# EAGLE design cropdroid-doser (EAGLE 9.7.0)
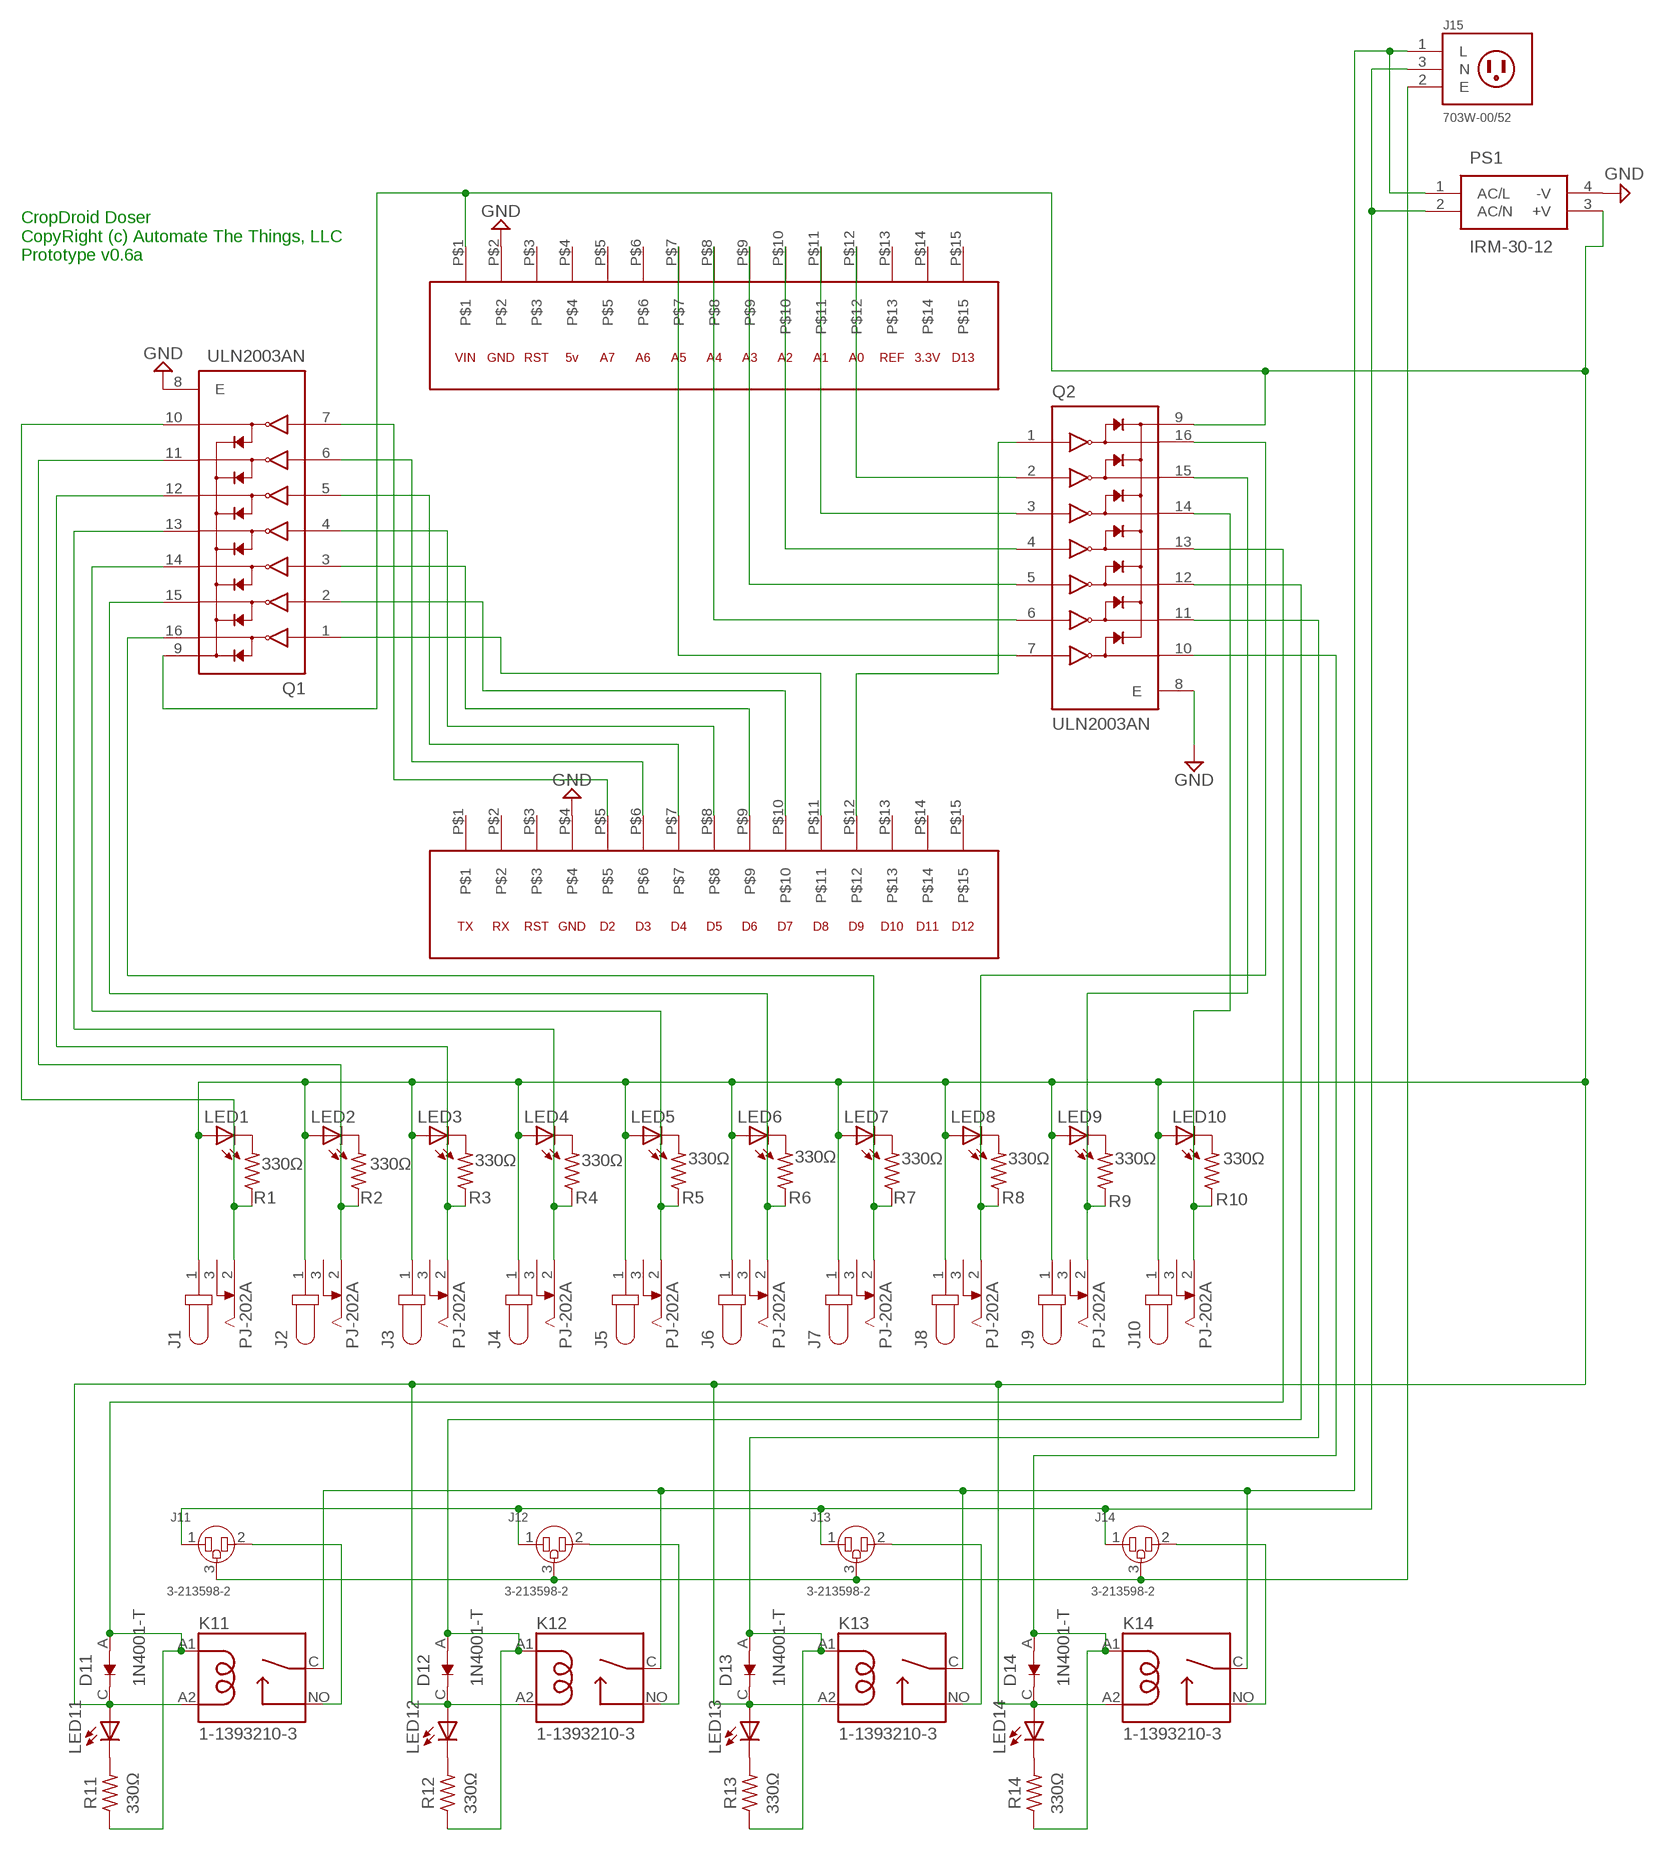
[diagram p0: schematic, sheet 1]

## Parts
D11  1N4001-T  [DIOAD953W69L521D272]
D12  1N4001-T  [DIOAD953W69L521D272]
D13  1N4001-T  [DIOAD953W69L521D272]
D14  1N4001-T  [DIOAD953W69L521D272]
J1  PJ-202A  [CUI_PJ-202A]
J2  PJ-202A  [CUI_PJ-202A]
J3  PJ-202A  [CUI_PJ-202A]
J4  PJ-202A  [CUI_PJ-202A]
J5  PJ-202A  [CUI_PJ-202A]
J6  PJ-202A  [CUI_PJ-202A]
J7  PJ-202A  [CUI_PJ-202A]
J8  PJ-202A  [CUI_PJ-202A]
J9  PJ-202A  [CUI_PJ-202A]
J10  PJ-202A  [CUI_PJ-202A]
J11  3-213598-2  [TE_3-213598-2]
J12  3-213598-2  [TE_3-213598-2]
J13  3-213598-2  [TE_3-213598-2]
J14  3-213598-2  [TE_3-213598-2]
J15  703W-00/52  [QUALTEK_703W-00/52]
K11  1-1393210-3  [TE_1-1393210-3]
K12  1-1393210-3  [TE_1-1393210-3]
K13  1-1393210-3  [TE_1-1393210-3]
K14  1-1393210-3  [TE_1-1393210-3]
LED1  LED3MM  [LED3MM]
LED2  LED3MM  [LED3MM]
LED3  LED3MM  [LED3MM]
LED4  LED3MM  [LED3MM]
LED5  LED3MM  [LED3MM]
LED6  LED3MM  [LED3MM]
LED7  LED3MM  [LED3MM]
LED8  LED3MM  [LED3MM]
LED9  LED3MM  [LED3MM]
LED10  LED3MM  [LED3MM]
LED11  LED3MM  [LED3MM]
LED12  LED3MM  [LED3MM]
LED13  LED3MM  [LED3MM]
LED14  LED3MM  [LED3MM]
PS1  IRM-30-12  [IRM3048]
Q1  ULN2003AN  [DIP794W45P254L1969H508Q16]
Q2  ULN2003AN  [DIP794W45P254L1969H508Q16]
R1  330Ω  R-US_AXIAL-7.2MM-PITCH  [RESAD724W46L381D178B]
R2  330Ω  R-US_AXIAL-7.2MM-PITCH  [RESAD724W46L381D178B]
R3  330Ω  R-US_AXIAL-7.2MM-PITCH  [RESAD724W46L381D178B]
R4  330Ω  R-US_AXIAL-7.2MM-PITCH  [RESAD724W46L381D178B]
R5  330Ω  R-US_AXIAL-7.2MM-PITCH  [RESAD724W46L381D178B]
R6  330Ω  R-US_AXIAL-7.2MM-PITCH  [RESAD724W46L381D178B]
R7  330Ω  R-US_AXIAL-7.2MM-PITCH  [RESAD724W46L381D178B]
R8  330Ω  R-US_AXIAL-7.2MM-PITCH  [RESAD724W46L381D178B]
R9  330Ω  R-US_AXIAL-7.2MM-PITCH  [RESAD724W46L381D178B]
R10  330Ω  R-US_AXIAL-7.2MM-PITCH  [RESAD724W46L381D178B]
R11  330Ω  R-US_AXIAL-7.2MM-PITCH  [RESAD724W46L381D178B]
R12  330Ω  R-US_AXIAL-7.2MM-PITCH  [RESAD724W46L381D178B]
R13  330Ω  R-US_AXIAL-7.2MM-PITCH  [RESAD724W46L381D178B]
R14  330Ω  R-US_AXIAL-7.2MM-PITCH  [RESAD724W46L381D178B]
U$1  PPTC151LFBN-RC  [PPTC151LFBN-RC]
U$2  PPTC151LFBN-RC  [PPTC151LFBN-RC]

## Nets
GND: PS1.4(-V) Q1.8(E) Q2.8(E) U$1.P$2 U$2.P$4
N$1: Q1.7(7B) U$2.P$5
N$2: Q1.6(6B) U$2.P$6
N$3: Q1.5(5B) U$2.P$7
N$4: Q1.4(4B) U$2.P$8
N$5: Q1.3(3B) U$2.P$9
N$6: Q1.2(2B) U$2.P$10
N$7: Q1.1(1B) U$2.P$11
N$8 [PowerSupply]: J15.1(L) K11.C K12.C K13.C K14.C PS1.1(AC/L)
N$9 [PowerSupply]: J11.1 J12.1 J13.1 J14.1 J15.3(N) PS1.2(AC/N)
N$10: D11.A K11.A1 Q2.13(4C) R11.1
N$11: Q2.1(1B) U$2.P$12
N$12: Q2.2(2B) U$1.P$12
N$13: Q2.3(3B) U$1.P$11
N$14: Q2.4(4B) U$1.P$10
N$15: Q2.5(5B) U$1.P$9
N$16: Q2.6(6B) U$1.P$8
N$17: Q2.7(7B) U$1.P$7
N$18: LED11.K(C) R11.2
N$19: LED13.K(C) R13.2
N$20 [MainsAC]: J11.2 K11.NO
N$21: LED14.K(C) R14.2
N$22: LED12.K(C) R12.2
N$23 [MainsAC]: J12.2 K12.NO
N$24: LED1.K(C) R1.2
N$25: LED2.K(C) R2.2
N$26 [MainsAC]: J13.2 K13.NO
N$28: LED3.K(C) R3.2
N$29 [MainsAC]: J14.2 K14.NO
N$30 [MainsAC]: J11.3 J12.3 J13.3 J14.3 J15.2(E)
N$37: J1.2 Q1.10(7C) R1.1
N$38: D14.A K14.A1 Q2.10(7C) R14.1
N$39: D13.A K13.A1 Q2.11(6C) R13.1
N$40: D12.A K12.A1 Q2.12(5C) R12.1
N$41: LED4.K(C) R4.2
N$44: LED8.K(C) R8.2
N$45: LED5.K(C) R5.2
N$46: LED6.K(C) R6.2
N$47: LED7.K(C) R7.2
N$48: J2.2 Q1.11(6C) R2.1
N$49: LED9.K(C) R9.2
N$50: LED10.K(C) R10.2
N$51: J3.2 Q1.12(5C) R3.1
N$52: J4.2 Q1.13(4C) R4.1
N$53 [PowerSupply]: D11.C D12.C D13.C D14.C J1.1 J2.1 J3.1 J4.1 J5.1 J6.1 J7.1 J8.1 J9.1 J10.1 K11.A2 K12.A2 K13.A2 K14.A2 LED1.A LED2.A LED3.A LED4.A LED5.A LED6.A LED7.A LED8.A LED9.A LED10.A LED11.A LED12.A LED13.A LED14.A PS1.3(+V) Q1.9(COM) Q2.9(COM) U$1.P$1
N$55: J5.2 Q1.14(3C) R5.1
N$56: J6.2 Q1.15(2C) R6.1
N$57: J7.2 Q1.16(1C) R7.1
N$58: J8.2 Q2.16(1C) R8.1
N$59: J9.2 Q2.15(2C) R9.1
N$60: J10.2 Q2.14(3C) R10.1
Unconnected: J1.3 J2.3 J3.3 J4.3 J5.3 J6.3 J7.3 J8.3 J9.3 J10.3 U$1.P$3 U$1.P$4 U$1.P$5 U$1.P$6 U$1.P$13 U$1.P$14 U$1.P$15 U$2.P$1 U$2.P$2 U$2.P$3 U$2.P$13 U$2.P$14 U$2.P$15

## Notes on the sheet
- CropDroid Doser
  CopyRight (c) Automate The Things, LLC
  Prototype v0.6a
- VIN | GND | RST | 5v | A7 | A6 | A5 | A4 | A3 | A2 | A1 | A0 | REF | 3.3V | D13
- TX | RX | RST | GND | D2 | D3 | D4 | D5 | D6 | D7 | D8 | D9 | D10 | D11 | D12

## Library data of the parts
D11-D14 = 1N4001-T:1N4001-T: Diode, Standard Recovery, 1a, 50v, Do-204al-2, Full Reel Check prices <https://pricing.snapeda.com/parts/1N4001/ON%20Semiconductor/view-part?ref=eda>; AVAILABILITY: In Stock; DESCRIPTION: Diode Standard 50V 1A Through Hole DO-204AL (DO-41); MF: ON Semiconductor; MP: 1N4001; PACKAGE: DO-41 Lite-On; PRICE: None
J1-J10 = PJ-202A:PJ-202A: 2.0 mm Center Pin, 2.5 A, Right Angle, Through Hole, Kinked Pins, Dc Power Jack Connector Check prices <https://pricing.snapeda.com/parts/PJ-202A/CUI%20Devices/view-part?ref=eda>; AVAILABILITY: In Stock; CUI_PURCHASE_URL: https://www.cuidevices.com/product/interconnect/connectors/dc-power-connectors/jacks/pj-202a?utm_source=snapeda.com&utm_medium=referral&utm_campaign=snapedaBOM; DESCRIPTION: 2.0 x 6.5 mm, 2.5 A, Horizontal, Through Hole, Kinked Pins, Dc Power Jack Connector; MF: CUI Devices; MP: PJ-202A; PACKAGE: None; PRICE: None
J11-J14 = 3-213598-2:3-213598-2: Conn Power RCP 2Power/1Ground POS 12.7mm Solder ST Thru-Hole 3 Terminal 1 Port Check prices <https://pricing.snapeda.com/parts/3-213598-2/TE%20Connectivity/view-part?ref=eda>; AVAILABILITY: In Stock; COMMENT: 3-213598-2; DESCRIPTION: OUTLET ASSEMBLY, 15A, CONVENIENCE; Series:-; Gender:Receptacle; Current Rating:1; EU_ROHS_COMPLIANCE: Compliant; MF: TE Connectivity; MP: 3-213598-2; PACKAGE: None; PRICE: None; PRODUCT_TYPE: Convenience Outlet; PURCHASE-URL: https://pricing.snapeda.com/search/part/3-213598-2/?ref=eda
J15 = 703W-00_52:703W-00/52: 3 Position 250 V 10 A Male Pins AC Receptacle Right Angle Connector Check prices <https://pricing.snapeda.com/parts/703W-00/52/Qualtek/view-part?ref=eda>; AVAILABILITY: In Stock; DESCRIPTION: Power Entry Connector Receptacle, Male Blades IEC 320-C14 Panel Mount, Flange; Through Hole, Right Angle; MF: Qualtek; MP: 703W-00/52; PACKAGE: None; PRICE: None
K11-K14 = 1-1393210-3:1-1393210-3: Electromechanical Relay 12VDC 144Ohm 30A SPST-NO (( 32.51mm 27.43mm 20.4mm)) THT Industrial Relay Check prices <https://pricing.snapeda.com/parts/T9AS1D12-12/TE%20Connectivity/view-part?ref=eda>; AVAILABILITY: In Stock; COMMENT: 1-1393210-3; DESCRIPTION: Electromechanical Relay 12VDC 144Ohm 30A SPST-NO (( 32.51mm 27.43mm 20.4mm)) THT Industrial Relay; MF: TE Connectivity; MP: T9AS1D12-12; PACKAGE: None; PRICE: None; PURCHASE-URL: https://pricing.snapeda.com/search/part/T9AS1D12-12/?ref=eda
LED1-LED14 = adafruit:LED: LED OSRAM: - CHIPLED LG R971, LG N971, LY N971, LG Q971, LY Q971, LO R971, LY R971 LH N974, LH R974 LS Q976, LO Q976, LY Q976 LO Q996 - Hyper CHIPLED LW Q18S LB Q993, LB Q99A, LB R99A - SideLED LS A670, LO A670, LY A670, LG A670, LP A670 LB A673, LV A673, LT A673, LW A673 LH A674 LY A675 LS A676, LA A676, LO A676, LY A676, LW A676 LS A679, LY A679, LG A679 - Hyper Micro SIDELED® LS Y876, LA Y876, LO Y876, LY Y876 LT Y87S - SmartLED LW L88C, LW L88S LB L89C, LB L89S, LG L890 LS L89K, LO L89K, LY L89K LS L896, LA L896, LO L896, LY L896 - TOPLED LS T670, LO T670, LY T670, LG T670, LP T670 LSG T670, LSP T670, LSY T670, LOP T670, LYG T670 LG T671, LOG T671, LSG T671 LB T673, LV T673, LT T673, LW T673 LH T674 LS T676, LA T676, LO T676, LY T676, LB T676, LH T676, LSB T676, LW T676 LB T67C, LV T67C, LT T67C, LS T67K, LO T67K, LY T67K, LW E67C LS E67B, LA E67B, LO E67B, LY E67B, LB E67C, LV E67C, LT E67C LW T67C LS T679, LY T679, LG T679 LS T770, LO T770, LY T770, LG T770, LP T770 LB T773, LV T773, LT T773, LW T773 LH T774 LS E675, LA E675, LY E675, LS T675 LS T776, LA T776, LO T776, LY T776, LB T776 LHGB T686 LT T68C, LB T68C - Hyper Mini TOPLED® LB M676 - Mini TOPLED Santana® LG M470 LS M47K, LO M47K, LY M47K Source: http://www.osram.convergy.de/
PS1 = IRM-30-12:IRM-30-12: Power Supply Encapsulated PCB 12V 30W Source: Datasheet <http://www.meanwell.com/Upload/PDF/IRM-30/IRM-30-SPEC.PDF>; ARROW_PART_NUMBER: IRM-30-12; ARROW_PRICE-STOCK: https://www.arrow.com/en/products/irm-30-12/mean-well-enterprises; DESCRIPTION: Power Supply Encapsulated PCB 12V 30W; HEIGHT: 24mm; MANUFACTURER_NAME: Mean Well; MANUFACTURER_PART_NUMBER: IRM-30-12; MOUSER_PART_NUMBER: 709-IRM30-12; MOUSER_PRICE-STOCK: https://www.mouser.co.uk/ProductDetail/MEAN-WELL/IRM-30-12?qs=Ubm%252Bqu3%2FQAv0qUuIjQjetQ%3D%3D
Q1 Q2 = ULN2003AN:ULN2003AN: Check prices <https://pricing.snapeda.com/parts/ULN2003AN/Texas%20Instruments/view-part?ref=eda>; AVAILABILITY: In Stock; DESCRIPTION: 50-V, 7-ch darlington transistor array, -20C to 70C 16-PDIP -40 to 70; MF: Texas Instruments; MP: ULN2003AN; PACKAGE: PDIP-16 Texas Instruments; PRICE: None; PURCHASE-URL: https://pricing.snapeda.com/search/part/ULN2003AN/?ref=eda
R1-R14 = Resistor:R-US: Resistor Fixed - ANSI; CATEGORY: Resistor; SUB-CATEGORY: Fixed
U$1 U$2 = PPTC151LFBN-RC:PPTC151LFBN-RC: Check prices <https://pricing.snapeda.com/parts/PPTC151LFBN-RC/Sullins%20Connector/view-part?ref=eda>; AVAILABILITY: In Stock; DESCRIPTION: 15 Position Header Connector 0.100 (2.54mm) Through Hole Tin; MF: Sullins Connector; MP: PPTC151LFBN-RC; PACKAGE: None; PRICE: None

## Net classes
0 default: width 0.254 mm, drill 0.381 mm, clearance 0.254 mm
1 MainsAC: width 6.299 mm, drill 0.381 mm, clearance 0.6 mm
2 PowerSupply: width 0.711 mm, drill 0.381 mm, clearance 0.254 mm

## Board
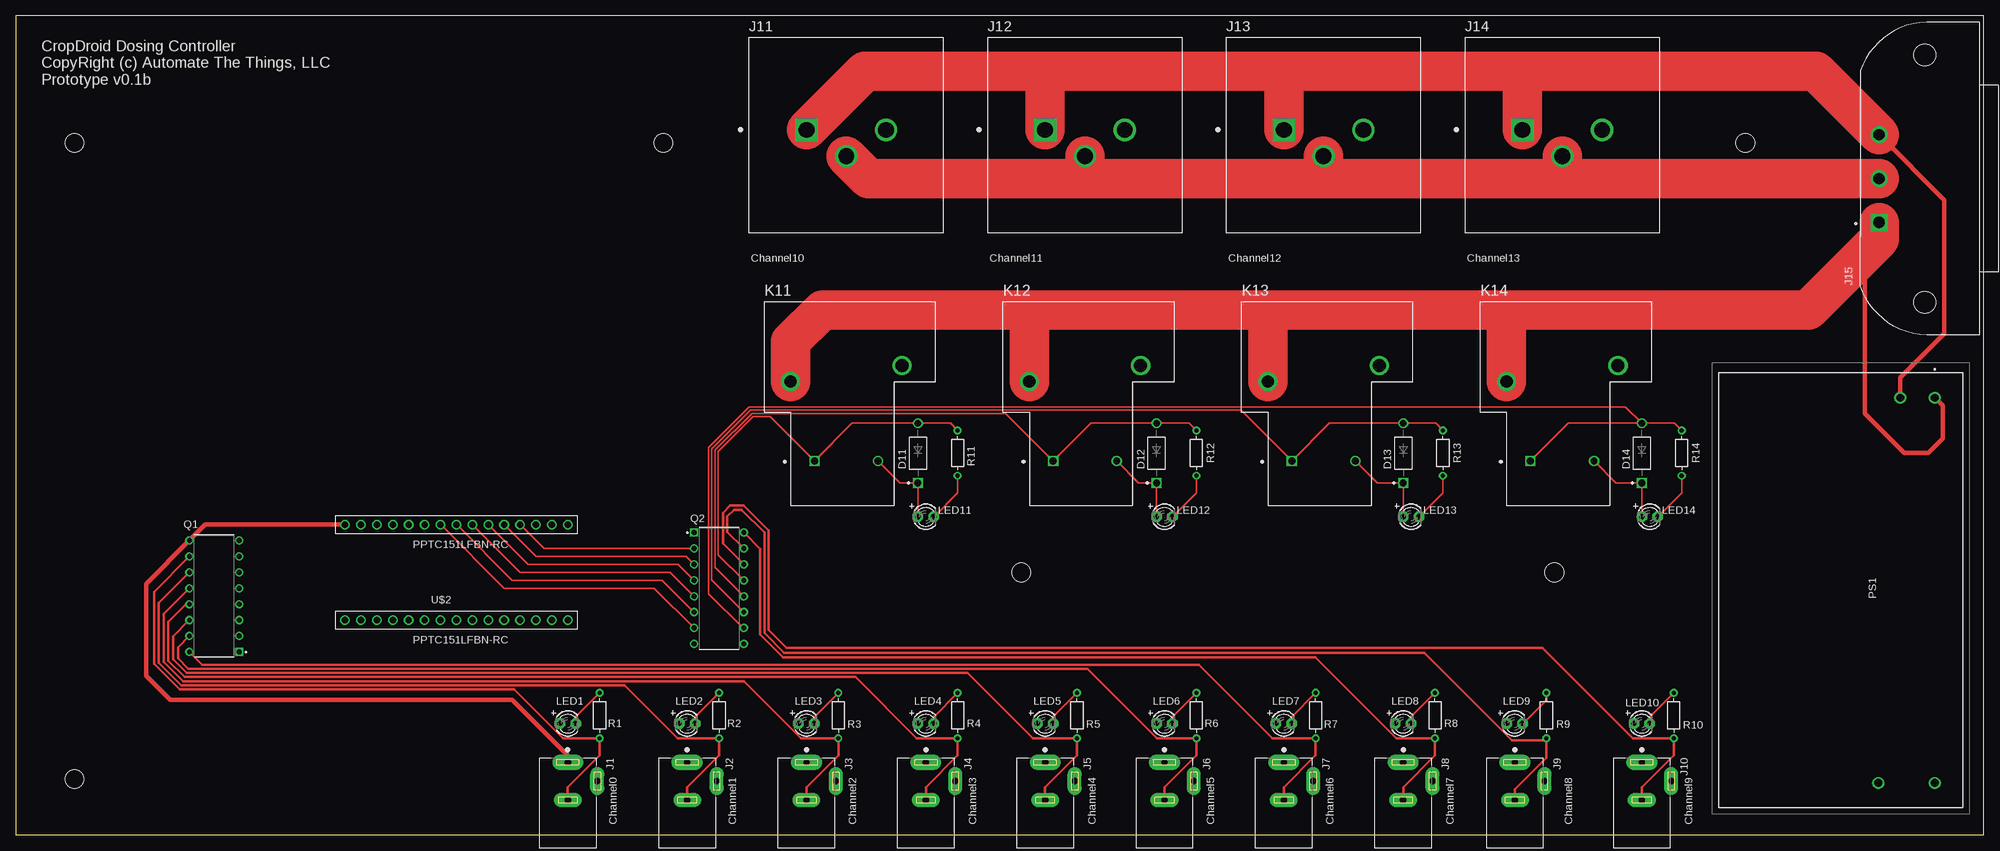
[diagram p1: board, top side]
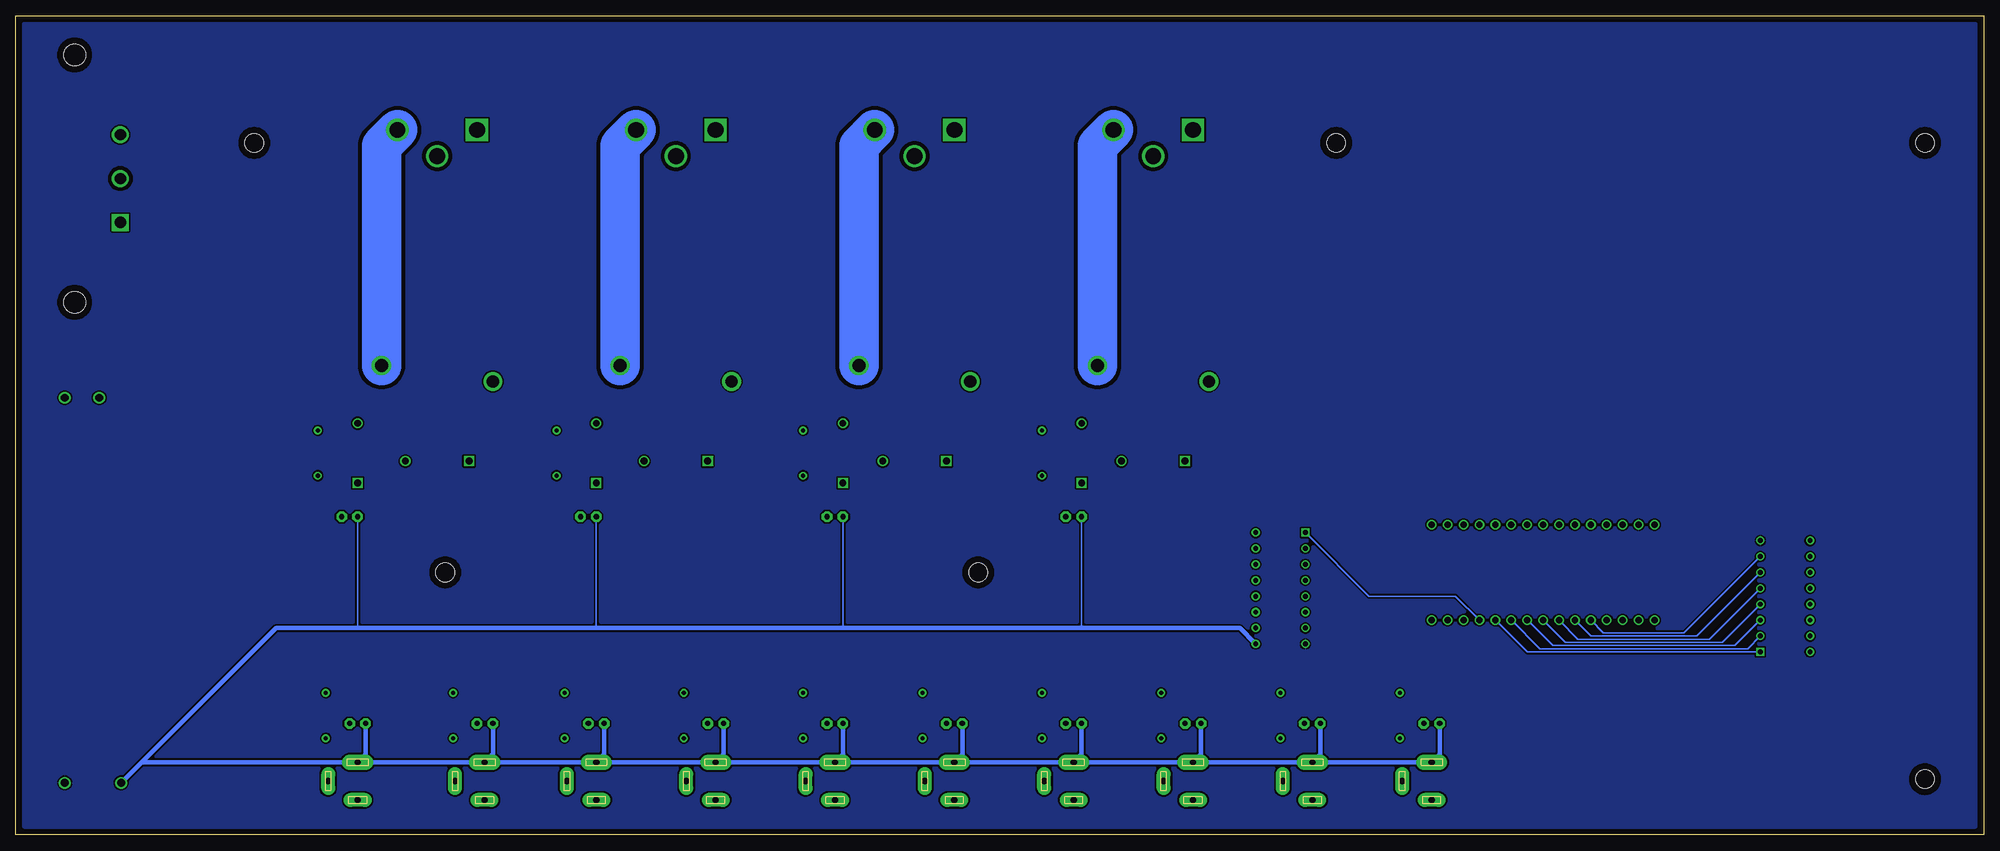
[diagram p2: board, bottom side, seen from below]

Size 314.18 x 130.82 mm. Coordinates in mm from the lower left corner, seen from the top.
Outline: 0,0 314.18,0 314.18,130.82 0,130.82 0,0
Copper layers (1*16): Top / Bottom
Stack-up Default Layer Stack: Top User Defined 0.035mm / Dielectric-1 User Defined 1.5mm / Bottom User Defined 0.035mm
Design rules: minimum copper width class=1 248mil, minimum copper width class=2 28mil, minimum copper width class=0 10mil, minimum copper width 10mil, minimum drill size class=1 15mil, minimum drill size class=2 15mil, minimum drill size class=0 15mil, minimum drill size 0.35mm, copper clearance class=1 to class=1 0.6mm, copper clearance class=2 to class=2 10mil, copper clearance class=0 to class=0 10mil, copper clearance wire_polygon to wire_polygon 10mil, copper clearance wire_polygon to pad_smd 10mil, copper clearance wire_polygon to via 10mil, copper clearance pad_smd to pad_smd 10mil, copper clearance pad_smd to via 10mil, copper clearance via to via 10mil, copper clearance smd to pad (same net) 6mil, copper clearance smd to via (same net) 6mil, copper clearance smd to smd (same net) 6mil, dimension clearance 40mil, via restrict clearance 0mil, restrict clearance 0mil, drill distance 6mil, keepout clearance 0mil
Holes 3 mm at 103.38,110.5 245.62,41.92 276.1,110.5 9.4,110.5 9.4,8.9 160.53,41.92

### Footprints (pad centres in the part's own frame; a part is rotated, then mirrored left to right if it is on the bottom)
DIOAD953W69L521D272 = drill 1.06 pad 1.59: A 4.765,0 | drill 1.06 pad 1.59 square: C -4.765,0
CUI_PJ-202A = drill 1 pad 2.5 long: 1 -6.5,0 | drill 1 pad 2.25 long: 2 -0.5,0; 3 -3.5,4.7
TE_3-213598-2 = drill 2.54 square: 1 -6.35,0.81 | drill 2.54: 2 6.35,0.81; 3 0,-3.38
QUALTEK_703W-00/52 = drill 1.8 square: 1 0,0 | drill 1.8: 2 7,0; 3 14,0 | hole 3.5: 26.75,-7.3; -12.75,-7.3
TE_1-1393210-3 = drill 1.09 square: A1 0,0 | drill 1.09: A2 10.16,0 | drill 1.98: C -3.81,12.7 | drill 2.06: NO 13.97,15.24
LED3MM = drill 0.813 pad 1.676 octagon: A -1.27,0; K 1.27,0
IRM3048 = drill 1.24 pad 1.86: 1 -30.425,15; 2 -30.425,9.5; 3 31.075,6; 4 31.075,15
DIP794W45P254L1969H508Q16 = drill 0.78 pad 1.13 square: 1 -3.97,8.89 | drill 0.78 pad 1.13: 2 -3.97,6.35; 3 -3.97,3.81; 4 -3.97,1.27; 5 -3.97,-1.27; 6 -3.97,-3.81; 7 -3.97,-6.35; 8 -3.97,-8.89; 9 3.97,-8.89; 10 3.97,-6.35; 11 3.97,-3.81; 12 3.97,-1.27; 13 3.97,1.27; 14 3.97,3.81; 15 3.97,6.35; 16 3.97,8.89
RESAD724W46L381D178B = drill 0.66 pad 1.26: 1 -3.62,0; 2 3.62,0
PPTC151LFBN-RC = drill 1.02: P$1 0,0; P$2 2.54,0; P$3 5.08,0; P$4 7.62,0; P$5 10.16,0; P$6 12.7,0; P$7 15.24,0; P$8 17.78,0; P$9 20.32,0; P$10 22.86,0; P$11 25.4,0; P$12 27.94,0; P$13 30.48,0; P$14 33.02,0; P$15 35.56,0

### Placement (x,y rotation side)
D11  144.02,60.97 90 top
D12  182.12,60.97 90 top
D13  221.49,60.97 90 top
D14  259.59,60.97 90 top
J1  88.14,5.09 270 top
J2  107.19,5.09 270 top
J3  126.24,5.09 270 top
J4  145.29,5.09 270 top
J5  164.34,5.09 270 top
J6  183.39,5.09 270 top
J7  202.44,5.09 270 top
J8  221.49,5.09 270 top
J9  239.33,5.09 270 top
J10  259.59,5.09 270 top
J11  132.59,111.77 0 top
J12  170.69,111.77 0 top
J13  208.79,111.77 0 top
J14  246.89,111.77 0 top
J15  297.46,97.8 90 top
K11  127.51,59.7 0 top
K12  165.61,59.7 0 top
K13  203.71,59.7 0 top
K14  241.81,59.7 0 top
LED1  88.14,17.79 0 top
LED2  107.19,17.79 0 top
LED3  126.24,17.79 0 top
LED4  145.29,17.79 0 top
LED5  164.34,17.79 0 top
LED6  183.39,17.79 0 top
LED7  202.44,17.79 0 top
LED8  221.49,17.79 0 top
LED9  239.27,17.79 0 top
LED10  259.59,17.79 0 top
LED11  145.29,50.81 0 top
LED12  183.39,50.81 0 top
LED13  222.76,50.81 0 top
LED14  260.86,50.81 0 top
PS1  291.34,39.38 270 top
Q1  31.7,38.11 180 top
Q2  112.27,39.38 0 top
R1  93.22,19.06 90 top
R2  112.27,19.06 90 top
R3  131.32,19.06 90 top
R4  150.37,19.06 90 top
R5  169.42,19.06 90 top
R6  188.47,19.06 90 top
R7  207.52,19.06 90 top
R8  226.57,19.06 90 top
R9  244.35,19.06 90 top
R10  264.67,19.06 90 top
R11  150.37,60.97 270 top
R12  188.47,60.97 270 top
R13  227.84,60.97 270 top
R14  265.94,60.97 270 top
U$1  52.58,49.54 0 top
U$2  52.58,34.3 0 top

### Tracks (layer width: path | path; a pad name or v marks a point on that pad's centre or on a via)
GND
  pour Bottom: 0,130.82 0,0 314.18,0 314.18,130.82
N$1
  Bottom 0.254: U$2.P$5 60.71,32.27 47.87,32.27 Q1.7
N$2
  Bottom 0.254: U$2.P$6 62.74,31.76 45.83,31.76 Q1.6
N$3
  Bottom 0.254: U$2.P$7 64.77,31.25 43.8,31.25 Q1.5
N$4
  Bottom 0.254: U$2.P$8 66.8,30.75 41.77,30.75 Q1.4
N$5
  Bottom 0.254: U$2.P$9 68.83,30.24 39.74,30.24 Q1.3
N$6
  Bottom 0.254: U$2.P$10 70.87,29.73 37.71,29.73 Q1.2
N$7
  Bottom 0.254: U$2.P$11 72.9,29.22 Q1.1
N$8
  Top 0.711: PS1.1 307.61,68.54 307.61,63.27 305.31,60.97 301.5,60.97 295.15,67.32 295.15,95.49 J15.1
  Top 6.299: 199.9,83.83 238,83.83 | 199.9,83.83 161.8,83.83 | 161.8,83.83 128.78,83.83 123.7,78.75 K11.C | K12.C 161.8,83.83 | K13.C 199.9,83.83 | K14.C 238,83.83 | 238,83.83 286.14,83.83 297.46,95.15 J15.1
N$9
  Top 0.711: J15.3 307.89,101.38 307.89,83.76 307.85,83.72 307.85,80.02 300.84,73.01 PS1.2
  Top 6.299: J15.3 287.33,121.93 239.27,121.93 | 239.27,121.93 202.44,121.93 | 202.44,121.93 164.34,121.93 | J12.1 164.34,121.93 | J13.1 202.44,121.93 | J14.1 240.54,120.66 239.27,121.93 | J11.1 135.59,121.93 164.34,121.93
N$10
  Top 0.254: R11.1 149.22,65.74 D11.A 133.54,65.74 K11.A1 120.4,66.81 117.72,66.81 112.14,61.23 112.14,44.75 Q2.13
N$11
  Bottom 0.254: U$2.P$12 84.33,38.11 98.14,38.11 Q2.1
N$12
  Top 0.254: Q2.2 84.33,45.73 U$1.P$12
N$13
  Top 0.254: U$1.P$11 83.06,44.46 107.03,44.46 Q2.3
N$14
  Top 0.254: U$1.P$10 81.79,43.19 105.76,43.19 Q2.4
N$15
  Top 0.254: U$1.P$9 80.52,41.92 104.49,41.92 Q2.5
N$16
  Top 0.254: U$1.P$8 79.25,40.65 103.22,40.65 Q2.6
N$17
  Top 0.254: U$1.P$7 77.98,39.38 101.95,39.38 Q2.7
N$18
  Top 0.254: R11.2 150.37,54.62 LED11.K
N$19
  Top 0.254: LED13.K 227.84,54.62 R13.2
N$20
  Bottom 6.299: J11.2 141.48,110.04 K11.NO
N$21
  Top 0.254: R14.2 265.94,54.62 LED14.K
N$22
  Top 0.254: LED12.K 188.47,54.62 R12.2
N$23
  Bottom 6.299: J12.2 179.58,110.04 K12.NO
N$24
  Top 0.406: LED1.K 89.41,18.87 R1.2
N$25
  Top 0.406: LED2.K 108.46,18.87 R2.2
N$26
  Bottom 6.299: K13.NO 217.68,110.04 J13.2
N$28
  Top 0.406: LED3.K 127.51,18.87 R3.2
N$29
  Bottom 6.299: J14.2 255.78,110.04 K14.NO
N$30
  Top 6.299: 170.69,104.8 J12.3 | J11.3 136.18,104.8 170.69,104.8 | J15.2 246.89,104.8 | 246.89,104.8 208.79,104.8 | 208.79,104.8 170.69,104.8 | J13.3 208.79,104.8 | J14.3 246.89,104.8
N$37
  Top 0.406: Q1.10 22.1,38.82 22.1,27.32 26.19,23.23 79.6,23.23 87.39,15.44 R1.1 93.22,12.71 88.14,7.63 J1.2
N$38
  Top 0.254: D14.A 247.84,65.74 K14.A1 | D14.A 264.79,65.74 R14.1 | D14.A 256.99,68.34 117.09,68.34 110.62,61.86 110.62,38.49 116.08,33.03 Q2.10
N$39
  Top 0.254: R13.1 226.69,65.74 D13.A 209.74,65.74 K13.A1 195.58,67.83 117.3,67.83 111.12,61.65 111.12,40.68 Q2.11
N$40
  Top 0.254: R12.1 187.32,65.74 D12.A 171.64,65.74 K12.A1 157.99,67.32 117.51,67.32 111.63,61.44 111.63,42.72 Q2.12
N$41
  Top 0.406: LED4.K 146.56,18.87 R4.2
N$44
  Top 0.406: LED8.K 222.76,18.87 R8.2
N$45
  Top 0.406: LED5.K 165.61,18.87 R5.2
N$46
  Top 0.406: LED6.K 184.66,18.87 R6.2
N$47
  Top 0.406: LED7.K 203.71,18.87 R7.2
N$48
  Top 0.406: Q1.11 22.86,37.05 22.86,27.49 26.46,23.89 97.23,23.89 105.68,15.44 R2.1 112.27,12.71 107.19,7.63 J2.2
N$49
  Top 0.406: R9.2 244.35,21.5 240.64,17.79 LED9.K
N$50
  Top 0.406: LED10.K 260.86,18.87 R10.2
N$51
  Top 0.406: Q1.12 23.62,35.27 23.62,27.66 26.73,24.55 116.28,24.55 125.39,15.44 R3.1 131.32,12.71 126.24,7.63 J3.2
N$52
  Top 0.406: Q1.13 27.18,36.84 24.38,34.05 24.38,27.83 27.01,25.21 134.06,25.21 143.83,15.44 R4.1 150.37,12.71 145.29,7.63 J4.2
N$53
  Top 0.254: K11.A2 141.16,56.21 D11.C LED11.A | K12.A2 179.26,56.21 D12.C LED12.A | K13.A2 217.36,56.21 D13.C LED13.A | K14.A2 255.46,56.21 D14.C LED14.A
  Top 0.711: U$1.P$1 30.27,49.54 Q1.9 20.83,40.09 20.83,25.41 24.64,21.6 79.25,21.6 88.14,12.71 J1.1
  Bottom 0.254: LED14.A 259.59,33.03 | LED13.A 221.49,33.03 | LED12.A 182.12,33.03 | LED11.A 144.02,33.03
  Bottom 0.711: 294.04,11.6 272.61,33.03 259.59,33.03 221.49,33.03 182.12,33.03 144.02,33.03 118.78,33.03 Q2.9 | PS1.3 294.04,11.6 | LED1.A 86.87,12.86 J1.1 J2.1 | J3.1 124.97,12.86 LED3.A | J6.1 182.12,12.86 LED6.A | J7.1 201.17,12.86 LED7.A | J8.1 220.22,12.86 LED8.A | J9.1 238,12.92 LED9.A | J10.1 258.32,12.86 LED10.A | LED2.A 105.92,12.86 J2.1 | 294.04,11.6 294.03,11.59 J10.1 | J10.1 J9.1 | J9.1 J8.1 | J8.1 J7.1 | J7.1 J6.1 | J3.1 J2.1 | J6.1 J5.1 | LED5.A 163.07,12.86 J5.1 | J5.1 J4.1 | LED4.A 144.02,12.86 J4.1 | J4.1 J3.1
N$55
  Top 0.406: Q1.14 25.15,31.71 25.15,28 27.28,25.87 151.94,25.87 162.37,15.44 R5.1 169.42,12.71 164.34,7.63 J5.2
N$56
  Top 0.406: Q1.15 25.91,29.93 25.91,28.18 27.55,26.53 171.07,26.53 182.16,15.44 R6.1 188.47,12.71 183.39,7.63 J6.2
N$57
  Top 0.406: Q1.16 29.77,27.19 188.85,27.19 200.6,15.44 R7.1 207.52,12.71 202.44,7.63 J7.2
N$58
  Top 0.406: Q2.16 118.85,45.66 118.85,31.99 122.51,28.33 207.52,28.33 220.41,15.44 R8.1 226.57,12.71 221.49,7.63 J8.2
N$59
  Top 0.406: Q2.15 113.56,48.41 113.56,50.84 114.64,51.91 115.91,51.91 119.51,48.31 119.51,32.27 122.68,29.09 224.86,29.09 238.85,15.11 244.35,15.11 R9.1 244.35,12.28 239.32,7.25 J9.2
N$60
  Top 0.406: Q2.14 112.9,46.53 112.9,51.45 114.03,52.57 116.18,52.57 120.17,48.59 120.17,32.75 123.06,29.86 243.71,29.86 258.13,15.44 R10.1 264.67,12.71 259.59,7.63 J10.2

### Text on the board
tPlace: CropDroid Dosing Controller / CopyRight (c) Automate The Things, LLC / Prototype v0.1b | Channel10 | Channel11 | Channel12 | Channel13 | Channel0 | Channel1 | Channel2 | Channel3 | Channel4 | Channel5 | Channel6 | Channel7 | Channel8 | Channel9